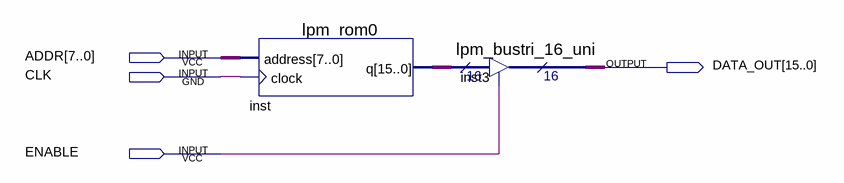
[diagram p0: schematic sheet]
// Quartus schematic memory_rom_oper.bdf as structural Verilog: 2 symbols, 4 pins
module memory_rom_oper (
  input  [7:0] ADDR,
  input  CLK,
  input  ENABLE,
  output [15:0] DATA_OUT
);

  wire [15:0] inst_q;

  lpm_rom0 inst (.address(ADDR), .clock(CLK), .q(inst_q));
  lpm_bustri_16_uni inst3 (.enabledt(ENABLE), .data(inst_q), .tridata(DATA_OUT));
endmodule
